# EAGLE design esp32-gps-eth-v12exp (EAGLE 7.3.0)
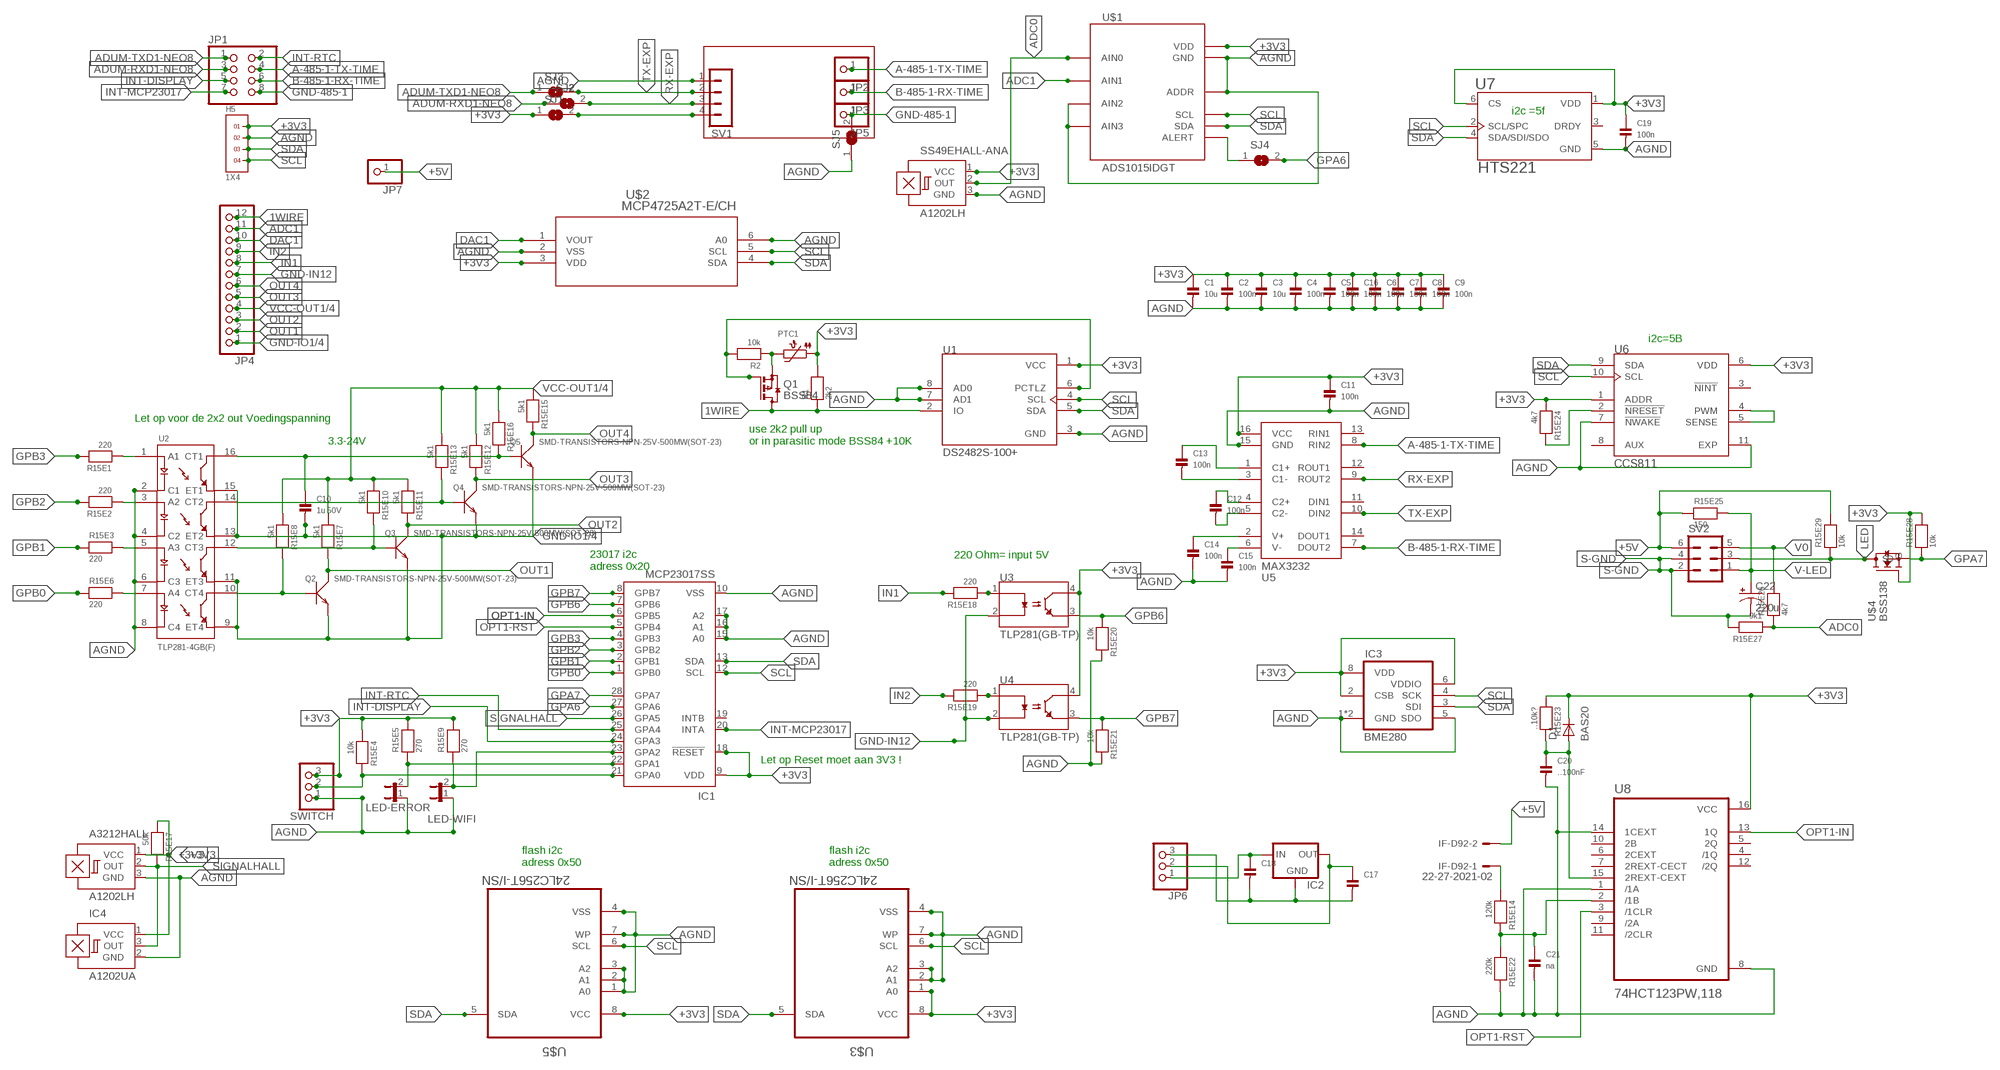
[diagram p0: schematic, sheet 1]

## Parts
A3212HALL  A1202LH  [SOT23-W]
C1  10u  CAP_CERAMIC0805  [0805]
C2  100n  CAP_CERAMIC0805  [0805]
C3  10u  CAP_CERAMIC0805  [0805]
C4  100n  CAP_CERAMIC0805  [0805]
C5  100n  CAP_CERAMIC0805  [0805]
C6  100n  CAP_CERAMIC0805  [0805]
C7  100n  CAP_CERAMIC0805  [0805]
C8  100n  CAP_CERAMIC0805  [0805]
C9  100n  CAP_CERAMIC0805  [0805]
C10  1u 50V  CAP_CERAMIC0805  [0805]
C11  100n  CAP_CERAMIC0805  [0805]
C12  100n  CAP_CERAMIC0805  [0805]
C13  100n  CAP_CERAMIC0805  [0805]
C14  100n  CAP_CERAMIC0805  [0805]
C15  100n  CAP_CERAMIC0805  [0805]
C16  100n  CAP_CERAMIC0805  [0805]
C17  CAP_CERAMIC0805  [0805]
C18  CAP_CERAMIC0805  [0805]
C19  100n  CAP_CERAMIC0805  [0805]
C20  ..100nF  CAP_CERAMIC0805  [0805]
C21  na  CAP_CERAMIC0805  [0805]
C22  220u  CPOL-US153CLV-0605  [153CLV-0605]
D1  BAS20  [SOT23]
H5  1X4  [1X4]
IC1  MCP23017SS  [SSOP28]
IC2  LM1117TO263  [TO263]
IC3  BME280  [BME280]
IC4  A1202UA  [SIP3-UA]
IF-D92  22-27-2021-02  [6410-02]
JP1  PINHD-2X4  [2X04]
JP2  PINHD-1X1  [1X01]
JP3  PINHD-1X1  [1X01]
JP4  PINHD-1X12  [1X12]
JP5  PINHD-1X1  [1X01]
JP6  PINHD-1X3  [1X03]
JP7  PINHD-1X1  [1X01]
LED-ERROR  JP1E  [JP1]
LED-WIFI  JP1E  [JP1]
PTC1  PTC1206  [1206]
Q1  BSS84  [SOT23]
Q2  SMD-TRANSISTORS-NPN-25V-500MW(SOT-23)  [SOT-23]
Q3  SMD-TRANSISTORS-NPN-25V-500MW(SOT-23)  [SOT-23]
Q4  SMD-TRANSISTORS-NPN-25V-500MW(SOT-23)  [SOT-23]
Q5  SMD-TRANSISTORS-NPN-25V-500MW(SOT-23)  [SOT-23]
R1  2k2  RESISTOR0805  [0805]
R2  10k  RESISTOR0805  [0805]
R15E1  220  RESISTOR_0805  [_0805]
R15E2  220  RESISTOR_0805  [_0805]
R15E3  220  RESISTOR_0805  [_0805]
R15E4  10k  RESISTOR_0805  [_0805]
R15E5  270  RESISTOR_0805  [_0805]
R15E6  220  RESISTOR_0805  [_0805]
R15E7  5k1  RESISTOR_0805  [_0805]
R15E8  5k1  RESISTOR_0805  [_0805]
R15E9  270  RESISTOR_0805  [_0805]
R15E10  5k1  RESISTOR_0805  [_0805]
R15E11  5k1  RESISTOR_0805  [_0805]
R15E12  5k1  RESISTOR_0805  [_0805]
R15E13  5k1  RESISTOR_0805  [_0805]
R15E14  120k  RESISTOR_0805  [_0805]
R15E15  5k1  RESISTOR_0805  [_0805]
R15E16  5k1  RESISTOR_0805  [_0805]
R15E17  50k  RESISTOR_0805  [_0805]
R15E18  220  RESISTOR_0805  [_0805]
R15E19  220  RESISTOR_0805  [_0805]
R15E20  10k  RESISTOR_0805  [_0805]
R15E21  10k  RESISTOR_0805  [_0805]
R15E22  220k  RESISTOR_0805  [_0805]
R15E23  ..10k?  RESISTOR_0805  [_0805]
R15E24  4k7  RESISTOR_0805  [_0805]
R15E25  150  RESISTOR_0805  [_0805]
R15E26  4k7  RESISTOR_0805  [_0805]
R15E27  9k1  RESISTOR_0805  [_0805]
R15E28  10k  RESISTOR_0805  [_0805]
R15E29  10k  RESISTOR_0805  [_0805]
SJ1  SJ  [SJ]
SJ2  SJ  [SJ]
SJ3  SJ  [SJ]
SJ4  SJ  [SJ]
SJ5  SJ  [SJ]
SS49EHALL-ANA  A1202LH  [SOT23-W]
SV1  MA04-1  [MA04-1]
SV2  MA03-2  [MA03-2]
SWITCH  PINHD-1X3  [1X03]
U1  DS2482S-100+  [SOIC127P600X175-8N]
U2  TLP281-4GB(F)  [SOIC127P700X210-16N]
U3  TLP281(GB-TP)  [SOIC127P700X210-4N]
U4  TLP281(GB-TP)  [SOIC127P700X210-4N]
U5  MAX3232  [SO16]
U6  CCS811  [SON60P270X400X110-11N]
U7  HTS221  [XDCR_HTS221]
U8  74HCT123PW,118  [SOP65P640X110-16N]
U$1  ADS1015IDGT  [MSOP10_0.5]
U$2  MCP4725A2T-E/CH  [SOT-23-6_MC]
U$3  24LC256T-I/SN  [SOIC127P600X175-8N]
U$4  BSS138  [BSS138]
U$5  24LC256T-I/SN  [SOIC127P600X175-8N]

## Nets
1WIRE: JP4.12 Q1.3(D) R1.1 U1.2(IO)
5VIN: C18.1 IC2.3(IN) JP6.1
+3V3: A3212HALL.1(VCC) C1.1 C2.1 C3.1 C4.1 C5.1 C6.1 C7.1 C8.1 C9.1 C11.1 C16.1 C19.1 D1.3(K) H5.1 IC1.9(VDD) IC1.18(!RESET) IC3.2(CSB) IC3.6(VDDIO) IC3.8(VDD) IC4.1(VCC) PTC1.1 R1.2 R15E4.1 R15E5.2 R15E9.2 R15E17.1 R15E23.1 R15E24.1 R15E28.2 SJ1.1 SS49EHALL-ANA.1(VCC) SWITCH.3 U1.1(VCC) U3.4(COLLECTOR) U4.4(COLLECTOR) U5.16(VCC) U6.1(ADDR) U6.6(VDD) U7.1(VDD) U7.6(CS) U8.16(VCC) U$1.8(VDD) U$2.3(VDD) U$3.1(A0) U$3.8(VCC) U$4.G U$5.8(VCC)
+5V: IF-D92.2 JP7.1 R15E25.1 R15E29.2 SV2.6
A-485-1-TX-TIME: JP1.4 JP2.1 U5.8(RIN2)
ADC0: R15E26.1 R15E27.1 SS49EHALL-ANA.2(OUT) U$1.4(AIN0)
ADC1: JP4.11 U$1.5(AIN1)
ADUM-RXD1-NEO8: JP1.3 SJ2.1
ADUM-TXD1-NEO8: JP1.1 SJ3.1
AGND: A3212HALL.3(GND) C1.2 C2.2 C3.2 C4.2 C5.2 C6.2 C7.2 C8.2 C9.2 C11.2 C14.2 C15.2 C16.2 C19.2 C20.2 C21.2 H5.2 IC1.10(VSS) IC1.15(A0) IC1.16(A1) IC1.17(A2) IC3.1(GND) IC3.5(SDO) IC3.7(GND) IC4.2(GND) LED-ERROR.1 LED-WIFI.1 R15E20.2 R15E21.2 R15E22.2 SJ5.1 SS49EHALL-ANA.3(GND) SV1.1 SWITCH.1 U1.3(GND) U1.7(AD1) U1.8(AD0) U2.2(C1) U2.4(C2) U2.6(C3) U2.8(C4) U5.15(GND) U6.7(!NWAKE) U6.11(EXP) U7.5(GND) U8.1(/1A) U8.8(GND) U8.14(1CEXT) U$1.1(ADDR) U$1.3(GND) U$1.6(AIN2) U$1.7(AIN3) U$2.2(VSS) U$2.6(A0) U$3.2(A1) U$3.3(A2) U$3.4(VSS) U$3.7(WP) U$5.1(A0) U$5.2(A1) U$5.3(A2) U$5.4(VSS) U$5.7(WP)
B-485-1-RX-TIME: JP1.6 JP3.1 U5.7(DOUT2)
DAC1: JP4.10 U$2.1(VOUT)
GND-485-1: JP1.8 JP5.1 SJ5.2
GND-IN: C17.2 C18.2 IC2.1(GND) JP6.3
GND-IN12: JP4.7 U3.2(CATHODE) U4.2(CATHODE)
GND-IO1/4: C10.2 JP4.1 Q2.2(E) Q3.2(E) Q4.2(E) Q5.2(E) U2.9(ET4) U2.11(ET3) U2.13(ET2) U2.15(ET1)
GPA6: IC1.27(GPA6) SJ4.2
GPA7: IC1.28(GPA7) R15E28.1 U$4.S
GPB0: IC1.1(GPB0) R15E6.1
GPB1: IC1.2(GPB1) R15E3.1
GPB2: IC1.3(GPB2) R15E2.2
GPB3: IC1.4(GPB3) R15E1.2
GPB6: IC1.7(GPB6) R15E20.1 U3.3(EMITTER)
GPB7: IC1.8(GPB7) R15E21.1 U4.3(EMITTER)
IN1: JP4.8 R15E18.2
IN2: JP4.9 R15E19.2
INT-DISPLAY: IC1.24(GPA3) JP1.5
INT-MCP23017: IC1.20(INTA) JP1.7
INT-RTC: IC1.25(GPA4) JP1.2
LED: R15E29.1 SV2.3 U$4.D
N$1: PTC1.2 Q1.2(S) R2.1
N$2: C13.1 U5.1(C1+)
N$3: SJ1.2 SV1.4
N$4: Q1.1(G) R2.2 U1.6(PCTLZ)
N$5: Q2.1(B) R15E8.2 U2.10(CT4)
N$6: R15E2.1 U2.3(A2)
N$7: R15E1.1 U2.1(A1)
N$8: IC1.21(GPA0) R15E4.2 SWITCH.2
N$9: IC1.22(GPA1) LED-ERROR.2 R15E5.1
N$10: IC1.23(GPA2) LED-WIFI.2 R15E9.1
N$11: R15E3.2 U2.5(A3)
N$12: R15E6.2 U2.7(A4)
N$13: Q3.1(B) R15E10.2 U2.12(CT3)
N$14: Q4.1(B) R15E13.2 U2.14(CT2)
N$15: C10.1 Q5.1(B) R15E16.2 U2.16(CT1)
N$16: C13.2 U5.3(C1-)
N$17: R15E19.1 U4.1(ANODE)
N$18: R15E18.1 U3.1(ANODE)
N$19: SJ4.1 U$1.2(ALERT)
N$20: C12.1 U5.4(C2+)
N$21: C12.2 U5.5(C2-)
N$25: C14.1 U5.2(V+)
N$26: C15.1 U5.6(V-)
N$35: R15E24.2 U6.2(!NRESET)
N$38: IF-D92.1 R15E14.1
N$39: C21.1 R15E14.2 R15E22.1 U8.2(/1B)
N$40: U6.4(PWM) U6.5(SENSE)
N$41: C20.1 D1.1(A) R15E23.2 U8.15(2REXT-CEXT)
OPT1-IN: IC1.6(GPB5) U8.13(1Q)
OPT1-RST: IC1.5(GPB4) U8.3(/1CLR)
OUT1: JP4.2 Q2.3(C) R15E7.2
OUT2: JP4.3 Q3.3(C) R15E11.2
OUT3: JP4.5 Q4.3(C) R15E12.2
OUT4: JP4.6 Q5.3(C) R15E15.2
RX-EXP: SJ2.2 SV1.3 U5.9(ROUT2)
S-GND: C22.- R15E27.2 SV2.2 SV2.4
SCL: H5.4 IC1.12(SCL) IC3.4(SCK) U1.4(SCL) U6.10(SCL) U7.2(SCL/SPC) U$1.10(SCL) U$2.5(SCL) U$3.6(SCL) U$5.6(SCL)
SDA: H5.3 IC1.13(SDA) IC3.3(SDI) U1.5(SDA) U6.9(SDA) U7.4(SDA/SDI/SDO) U$1.9(SDA) U$2.4(SDA) U$3.5(SDA) U$5.5(SDA)
SIGNALHALL: A3212HALL.2(OUT) IC1.26(GPA5) IC4.3(OUT) R15E17.2
TX-EXP: SJ3.2 SV1.2 U5.10(DIN2)
V0: R15E26.2 SV2.5
V-LED: C22.+ R15E25.2 SV2.1
VCC-OUT1/4: JP4.4 R15E7.1 R15E8.1 R15E10.1 R15E11.1 R15E12.1 R15E13.1 R15E15.1 R15E16.1
VOUT: C17.1 IC2.2(OUT) JP6.2
Unconnected: IC1.19(INTB) U5.11(DIN1) U5.12(ROUT1) U5.13(RIN1) U5.14(DOUT1) U6.3(!NINT) U6.8(AUX) U7.3(DRDY) U8.4(/1Q) U8.5(2Q) U8.6(2CEXT) U8.7(2REXT-CECT) U8.9(/2A) U8.10(2B) U8.11(/2CLR) U8.12(/2Q)

## Notes on the sheet
- i2c =5f
- i2c=5B
- Let op voor de 2x2 out Voedingspanning
- 3.3-24V
- use 2k2 pull up
  or in parasitic mode BSS84 +10K
- 220 Ohm= input 5V
- 23017 i2c 
  adress 0x20
- Let op Reset moet aan 3V3 !
- flash i2c
  adress 0x50
- flash i2c
  adress 0x50

## Library data of the parts
A3212HALL IC4 SS49EHALL-ANA = allegro:A12*?: Hall-effect bipolar switch Source: http://www.allegromicro.com/en/Products/Part_Numbers/1202/1202.pdf; OC_FARNELL: unknown; OC_NEWARK: unknown
C1-C21 = microbuilder:CAP_CERAMIC: Ceramic Capacitors 0402 - 0402 Surface Mount Capacitors 16pF 50V 5% [Digikey: 445-4899-2-ND] 18pF 50V 5% [Digikey: 490-1281-2-ND] 22pF 50V 5% [Digikey: 490-1283-2-ND] 68pF 50V 5% [Digikey: 490-1289-2-ND] 0.1uF 10V 10% [Digikey: 490-1318-2-ND] 1.0uF 6.3V 10% [Digikey: 490-1320-2-ND] 0603 - 0603 Surface Mount Capacitors 16 pF 50V 5% [Digikey: 445-5051-2-ND] 22 pF 50V [Digikey: PCC220ACVTR-ND] 33 pF 50V 5% [Digikey: 490-1415-1-ND] 56pF 50V 5% [Digikey: 490-1421-1-ND] 220pF 50V 5% [Digikey: 445-1285-1-ND] 680 pF 50V 2200 pF 50V 5% C0G [Digikey: 445-1297-1-ND] 5600 pF 100V 5% X7R [Digikey: 478-3711-1-ND] 0.1 µF 25V 10% [Digikey: PCC2277TR-ND] 0.22 µF 16V 10% X7R [Digikey: 445-1318-1-ND] 1.0 µF 25V 10% [Digikey: 445-5146-2-ND] 0603 - RF Specific 3pF 250V +/-0.1pF RF [Digikey: 712-1347-1-ND] 18 pF 250V 5% [Digikey: 478-3505-1-ND or 712-1322-1-ND] 56 pF 250V 5% C0G RF [Digikey: 490-4867-1-ND] 68 pF 250V RF [Digikey: 490-4868-1-ND] 0805 - 0805 Surface Mount Capacitors 220 pF 250V 2% RF Ceramic Capacitor [Digikey: 712-1398-1-ND] 1000 pF 50V 2% NP0 Ceramic Capacitor [Digikey: 478-3760-1-ND] 0.1 µF 25V 10% Ceramic Capacitor [Digikey: PCC1828TR-ND] 1.0 µF 16V 10% Ceramic Capacitor[Digikey: 490-1691-2-ND] 10.0 µF 10V 10% Ceramic Capacitor[Digikey: 709-1228-1-ND] 10.0 uF 16V 10% Ceramic Capacitor [Digikey: 478-5165-2-ND] 47 uF 6.3V 20% Ceramic Capacitor [Digikey: 587-1779-1-ND or 399-5506-1-ND] 1206 - 1206 Surface Mount Capacitors 47uF 10V 20% Ceramic Capacitor [Digikey: 490-5528-1-ND or 399-5508-1-ND or 445-6010-1-ND] 100uF 6.3V -20%, +80% Y5V Ceramic Capacitor (Digikey: 490-4512-1-ND, Mouser: 81-GRM31CF50J107ZE1L)
C22 = adafruit:CPOL-US: POLARIZED CAPACITOR, American symbol
D1 = BAS20:BAS20: General purpose diode The BAS19, BAS20 and BAS21 are general purpose diodes fabricated in planar technology, and encapsulated in a small SOT23 plastic SMD package. AAL Eindhoven MK; AVAILABILITY: Unavailable; DESCRIPTION: BAS20 Series 350 mW 200 V Max Reverse Voltage 200 mA High Voltage Diode-SOT-23-3; MF: ON Semiconductor; MP: BAS20; PACKAGE: SOT-23 ON Semiconductor; PRICE: None
H5 = headers(.1in):1X4
IC1 = microchip:MCP23017: http://ww1.microchip.com/downloads/en/DeviceDoc/21952a.pdf Source: http://ww1.microchip.com/downloads/en/DeviceDoc/21952a.pdf; MF: MICROCHIP; MPN: MCP23017-E/SS; OC_FARNELL: 1467674; OC_NEWARK: 31K2960
IC2 = v-reg-3:LM1117
IC3 = bosch-bme280:BME280: DIGITAL HUMIDITY, PRESSURE AND TEMPERATURE SENSOR * Digital interface I²C (up to 3.4 MHz) and SPI (3 and 4 wire, up to 10 MHz)* Supply voltage VDD main supply voltage range: 1.71 V to 3.6 V*VDDIO interface voltage range: 1.2 V to 3.6 V Operating range -40…+85 °C, 0…100 % rel. humidity, 300…1100 hPa The library has been designed by Richard Magdycz <https://www.facebook.com/groups/eaglecadsoftUK>
IF-D92 = con-molex:22-?-02: CONNECTOR wire to board 2.54 mm (.1 inch) pitch header; OC_FARNELL: unknown; OC_NEWARK: unknown
JP1 = adafruit:PINHD-2X4: PIN HEADER
JP2 JP3 JP5 JP7 = adafruit:PINHD-1X1: Pin header 1x1 for 0.1" spacing With round pins
JP4 = adafruit:PINHD-1X12: PIN HEADER
JP6 SWITCH = adafruit:PINHD-1X3: PIN HEADER
LED-ERROR LED-WIFI = jumper:JP1E: JUMPER
PTC1 = microbuilder:PTC: PTC (Resettable Fuse) 1206 Package 250mA PTC (16V Max, Time-to-Trip: 0.08s) - Digikey: F2110CT-ND 1210 Package 100mA PTC (30V Max, Time-to-Trip: 0.6s) - Digikey: MF-USMF010-2CT-ND 1812 Package 750mA PTC (24V Max, Time-to-Trip: 0.2s) - Digikey: MF-MSMF075/24-2CT-ND
Q1 = transistor-small-signal:BSS84: P-CHANNEL MOS FET
Q2-Q5 = SMD-TRANSISTORS-NPN-25V-500MW_SOT-23_:SMD-TRANSISTORS-NPN-25V-500MW(SOT-23): 305010017; AVAILABILITY: Unavailable; MF: Micro Commercial; MP: S8050; PACKAGE: SOT-23 Micro Commercial; PRICE: None
R1 R2 R15E1-R15E29 = microbuilder:RESISTOR: Resistors 0402 - 0402 Surface Mount Package 22 Ohm 1% 1/16W [Digikey: 311-22.0LRTR-ND] 33 Ohm 5% 1/16W 1.0K 5% 1/16W 1.5K 5% 1/16W 2.0K 1% 1/16W 10.0K 1% 1/16W [Digikey: 311-10.0KLRTR-ND] 10.0K 5% 1/16W [Digikey: RMCF0402JT10K0TR-ND] 12.1K 1% 1/16W [Digikey: 311-22.0LRTR-ND] 100.0K 5% 1/16W 0603 - 0603 Surface Mount Package 0 Ohm 1/10 Watt 1% Resistor 15 Ohm 1/10 Watt 1% Resistor 33 Ohm 1/10 Watt 1% Resistor 49.9 Ohm 1/10 Watt 1% Resistor 100 Ohm 1/10 Watt 1% Resistor 150 Ohm 1/10 Watt 1% Resistor 240 Ohm 1/10 Watt 1% Resistor 390 Ohm 1/10 Watt 1% Resistor 560 Ohm 1/10 Watt 1% Resistor 680 Ohm 1/10 Watt 1% Resistor 750 Ohm 1/10 Watt 1% Resistor 1.0K Ohm 1/10 Watt 1% Resistor 1.5K Ohm 1/10 Watt 1% Resistor 2.0K Ohm 1/10 Watt 1% Resistor 2.2K Ohm 1/10 Watt 1% Resistor 3.3K Ohm 1/10 Watt 1% Resistor 4.7K Ohm 1/10 Watt 1% Resistor 10.0K Ohm 1/10 Watt 1% Resistor 12.0K Ohm 1/10 Watt 1% Resistor 12.1K Ohm 1/10 Watt 1% Resistor 20.0K Ohm 1/10 Watt 1% Resistor 33.0K Ohm 1/10 Watt 1% Resistor 100.0K Ohm 1/10 Watt 1% Resistor 0805 - 0805 Surface Mount Package 0 Ohm 1/8 Watt 1% Resistor 33 Ohm 1/8 Watt 1% Resistor 100 Ohm 1/8 Watt 1% Resistor 150 Ohm 1/8 Watt 1% Resistor 200 Ohm 1/8 Watt 1% Resistor 240 Ohm 1/8 Watt 1% Resistor 330 Ohm 1/8 Watt 1% Resistor 390 Ohm 1/8 Watt 1% Resistor 470 Ohm 1/8 Watt 1% Resistor 1.0K Ohm 1/8 Watt 1% Resistor 1.5K Ohm 1/8 Watt 1% Resistor 2.0K Ohm 1/8 Watt 1% Resistor 4.7K Ohm 1/8 Watt 1% Resistor 5.1K Ohm 1/8 Watt 1% Resistor 5.6K Ohm 1/8 Watt 1% Resistor 10.0K Ohm 1/8 Watt 1% Resistor 22.0K Ohm 1/8 Watt 1% Resistor 33.0K Ohm 1/8 Watt 1% Resistor 100K Ohm 1/8 Watt 1% Resistor 1206 - 1206 Surface Mount Package 2012 - 2010 Surface Mount Package 0.11 Ohm 1/2 Watt 1% Resistor - Digikey: RHM.11UCT-ND
SJ1-SJ5 = jumper:SJ: SMD solder JUMPER
SV1 = con-lstb:MA04-1: PIN HEADER; OC_FARNELL: unknown; OC_NEWARK: unknown
SV2 = con-lstb:MA03-2: PIN HEADER; OC_FARNELL: unknown; OC_NEWARK: unknown
U1 = DS2482S-100_:DS2482S-100+: DS2460S Series 5.5 V 400 kHz I2C Surface Mount Smart Card Interface IC - SOIC-8; AVAILABILITY: Unavailable; DESCRIPTION: I²C to 1-wire Interface-IC [Maxim] DS2482S-100+ I²C to 1-wire Interface-IC; MF: Maxim Integrated; MP: DS2482S-100+; PACKAGE: SOIC-8 Maxim; PRICE: None
U2 = TLP281-4GB_F_:TLP281-4GB(F): Optocoupler DC-IN 4-CH Transistor DC-OUT 16-Pin SOP; AVAILABILITY: Unavailable; DESCRIPTION: Optocoupler DC-IN 4-CH Transistor DC-OUT 16-Pin SOP; MF: Toshiba; MP: TLP281-4GB_F_; PACKAGE: SOP-16 Toshiba; PRICE: None
U3 U4 = TLP281_GB-TP_:TLP281(GB-TP): Optocoupler DC-IN 1-CH Transistor DC-OUT 4-Pin SOP T/R; AVAILABILITY: Unavailable; DESCRIPTION: Optocoupler DC-IN 1-CH Transistor DC-OUT 4-Pin SOP T/R; MF: Toshiba Semiconductor; MP: TLP281_GB-TP_; PACKAGE: SOP-4 Toshiba; PRICE: None
U5 = MAX3232:MAX3232: RS-232 Line Driver/Receiver; AVAILABILITY: Unavailable; MF: Texas Instruments; MP: MAX3232; PACKAGE: SOIC-16 Texas Instruments; PRICE: None
U6 = CCS811:CCS811: Low Power Digital Sensor For Ind; AVAILABILITY: Unavailable; DESCRIPTION: Low Power Digital Sensor For Ind; MF: ams; MP: CCS811; PACKAGE: LGA-11 ams; PRICE: None
U7 = HTS221:HTS221: Capacitive digital sensor for relative humidity and temperature; AVAILABILITY: Unavailable; DESCRIPTION: Capacitive digital sensor for relative humidity and temperature; MF: STMicroelectronics; MP: HTS221; PACKAGE: VFLGA-6 STMicroelectronics; PRICE: None
U8 = 74HCT123PW_118:74HCT123PW,118: None; AVAILABILITY: Unavailable; DESCRIPTION: 74HC_T_123 - Dual retriggerable monostable multivibrator with reset; MF: Nexperia USA; MP: 74HCT123PW,118; PACKAGE: TSSOP-16 NXP Semiconductors; PRICE: None
U$1 = ADS1015:ADS1015: Ti ADS1015 12-bit ADC Ultra-Small, Low-Power, 12-Bit Analog-to-Digital Converter with Internal Reference The ADS1013, ADS1014, and ADS1015 are precision analog-to-digital converters (ADCs) with 12 bits of resolution offered in an ultra-small, leadless QFN-10 package or an MSOP-10 package. \ Source: http://focus.ti.com/docs/prod/folders/print/ads1015.html; AVAILABILITY: Unavailable; DESCRIPTION: 12-Bit ADC with Integrated MUX PGA Comparator Oscillator and Reference; MF: Texas Instruments; MP: ADS1015; PACKAGE: XFQFN-10 Texas Instruments; PRICE: None
U$2 = MCP4725A2T-E_CH:MCP4725A2T-E/CH; AVAILABILITY: Unavailable; DESCRIPTION: MCP4725 Series 1 Ch I2C EEPROM Memory 5.5 V 12-Bit D/A Converter SMT - SOT-23-6; MF: Microchip; MP: MCP4725A2T-E/CH; PACKAGE: SOT-23-6 Microchip; PRICE: None
U$3 U$5 = Microchip_By_element14_Batch_1:24LC256T-I/SN: 256K I2C CMOS Serial EEPROM; MPN: 24LC256T-I/SN; OC_FARNELL: 1296581; OC_NEWARK: 27C9147; PACKAGE: SOIC-8; SUPPLIER: MICROCHIP
U$4 = Ava:BSS138: BSS138 N-Channel Logic Level Enhancement Mode Field Effect Transistor

## Board
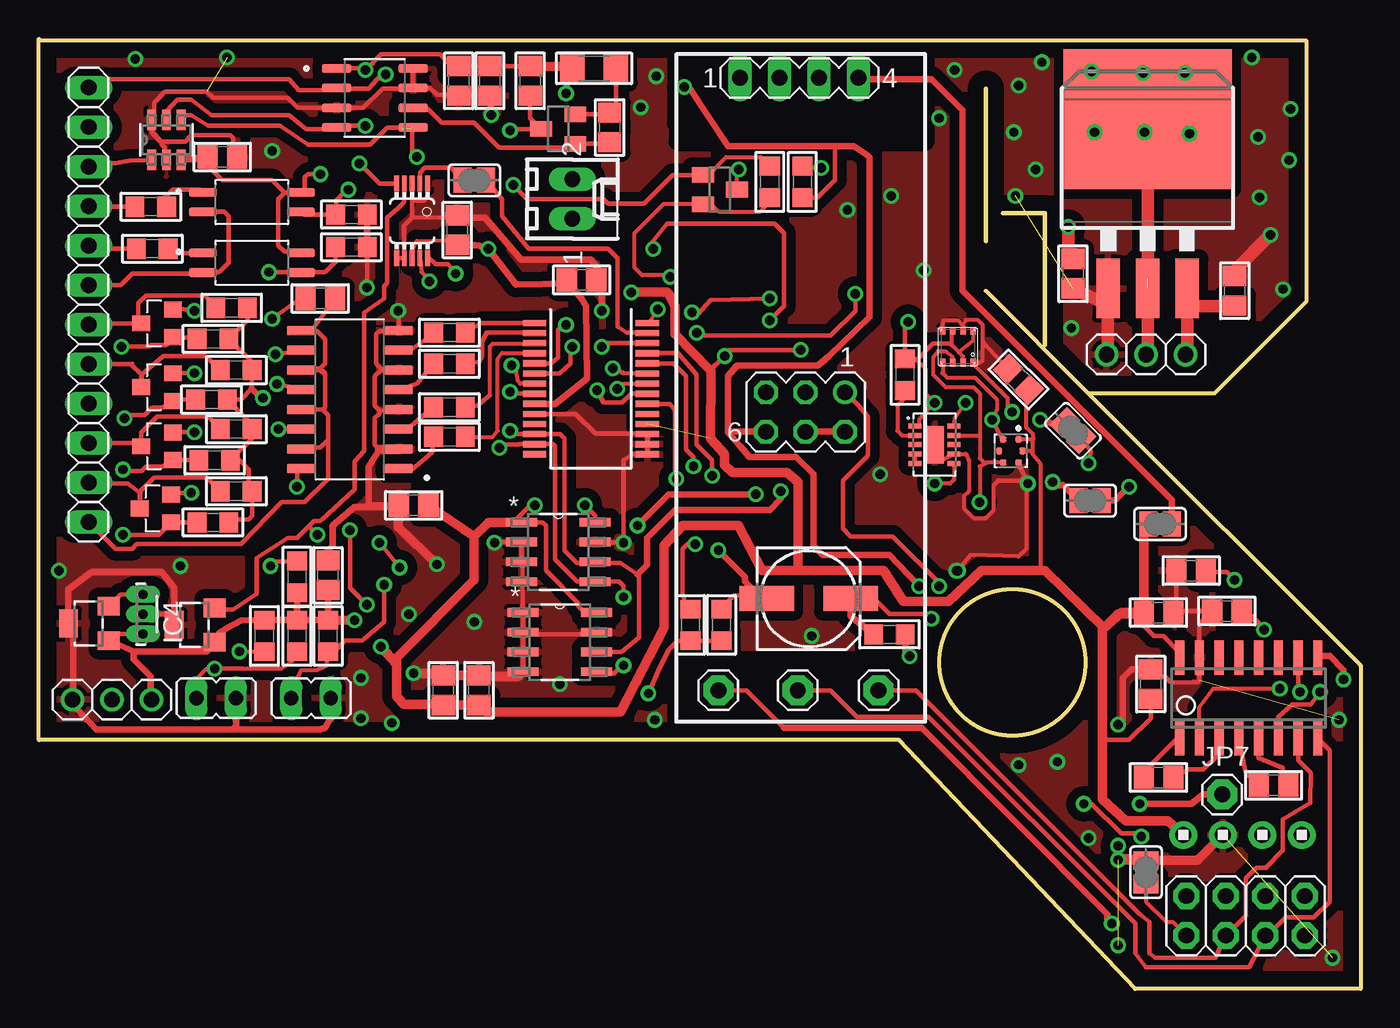
[diagram p1: board, top side]
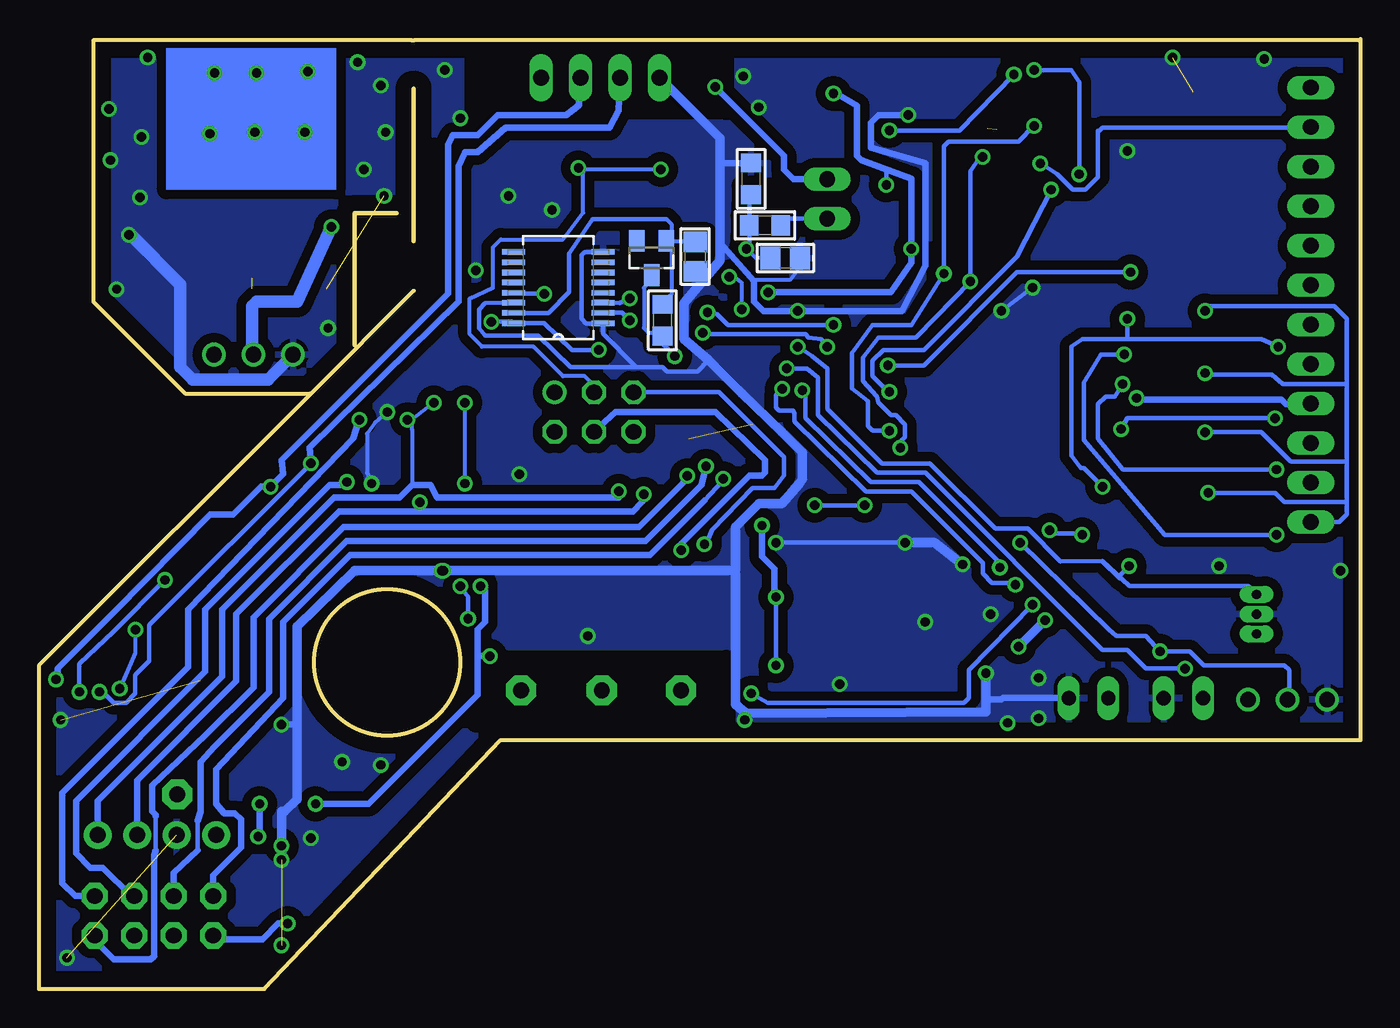
[diagram p2: board, bottom side, seen from below]

Size 85 x 61.1 mm. Coordinates in mm from the lower left corner, seen from the top.
Outline: 0.1,61 60.9,61
Outline: 60.9,44.9 67.5,38.3
Outline: 67.5,38.3 85,20.8 85,0 70.5,0 55.3,16 0,16 0,61.1
Outline: 60.9,57.9 60.9,48.1
Outline: 61,61 81.5,61 81.5,44.2 75.6,38.3 67.5,38.3
Outline: 64.7,41.4 64.7,49.9 62,49.9
Outline: circle at 62.6,21 radius 4.7
Copper layers (1*16): Top 0.035mm / dielectric 1.5mm / Bottom 0.035mm
Design rules "default *": minimum track width 5mil, minimum drill 24mil, track to track 5mil, track to pad 8mil, pad to pad 8mil, via to via 8mil, smd to smd 8mil, copper to edge 40mil, drill to drill 8mil, minimum pad ring 10mil, minimum via ring 8mil, stop-mask expansion 4mil, vias tented up to drill 0mil, thermal gap 10mil
tKeepout: area 41,17.2 to 57.1,21.3
tRestrict: area 41,16.7 to 56.9,21.1; area 41,55.7 to 56.9,60.1; area 41.1,56.5 to 57,60.9; area 41.1,54.5 to 57,58.9
bRestrict: area 40.8,17.1 to 56.9,21.2; area 40.9,56.5 to 57,60.6

### Footprints (pad centres in the part's own frame; a part is rotated, then mirrored left to right if it is on the bottom)
SOT23-W = smd 1.2 x 1.4: 1 -1.1,-1.3; 2 1.1,-1.3 | smd 1.8 x 1.2: 3 0,1.3
0805 = smd 1.3 x 1.5: 1 -0.95,0; 2 0.95,0
153CLV-0605 = smd 3.5 x 1.6: + 2.7,0; - -2.7,0
SOT23 = smd 1 x 1.4: 1 -0.95,-1.1; 2 0.95,-1.1; 3 0,1.1
1X4 = drill 1.016 pad 1.778: 1 0,0; 2 2.54,0; 3 5.08,0; 4 7.62,0
SSOP28 = smd 0.4 x 1.5: 1 -4.225,-3.625; 2 -3.575,-3.625; 3 -2.925,-3.625; 4 -2.275,-3.625; 5 -1.625,-3.625; 6 -0.975,-3.625; 7 -0.325,-3.625; 8 0.325,-3.625; 9 0.975,-3.625; 10 1.625,-3.625; 11 2.275,-3.625; 12 2.925,-3.625; 13 3.575,-3.625; 14 4.225,-3.625; 15 4.225,3.625; 16 3.575,3.625; 17 2.925,3.625; 18 2.275,3.625; 19 1.625,3.625; 20 0.975,3.625; 21 0.325,3.625; 22 -0.325,3.625; 23 -0.975,3.625; 24 -1.625,3.625; 25 -2.275,3.625; 26 -2.925,3.625; 27 -3.575,3.625; 28 -4.225,3.625
TO263 = smd 1.524 x 3.81: 1 -2.54,-8.255; 2 0,-8.255; 3 2.54,-8.255 | smd 10.8 x 9: 4 0,2.635
BME280 = smd 0.35 x 0.5: 1 0.975,-1.025; 2 0.325,-1.025; 3 -0.325,-1.025; 4 -0.975,-1.025; 5 -0.975,1.025; 6 -0.325,1.025; 7 0.325,1.025; 8 0.975,1.025
SIP3-UA = drill 0.6 pad 0.7 long: 1 -1.27,0; 2 0,0; 3 1.27,0
6410-02 = drill 1.016 long: 1 1.27,0; 2 -1.27,0
2X04 = drill 1.016 pad 1.676 octagon: 1 -3.81,-1.27; 2 -3.81,1.27; 3 -1.27,-1.27; 4 -1.27,1.27; 5 1.27,-1.27; 6 1.27,1.27; 7 3.81,-1.27; 8 3.81,1.27
1X01 = drill 1.016 pad 1.93 octagon: 1 0,0
1X12 = drill 1.016 long: 1 -13.97,0; 2 -11.43,0; 3 -8.89,0; 4 -6.35,0; 5 -3.81,0; 6 -1.27,0; 7 1.27,0; 8 3.81,0; 9 6.35,0; 10 8.89,0; 11 11.43,0; 12 13.97,0
1X03 = drill 1.016: 1 -2.54,0; 2 0,0; 3 2.54,0
JP1 = drill 0.914 long: 1 0,-1.27; 2 0,1.27
1206 = smd 1.6 x 1.8: 1 -1.4,0; 2 1.4,0
SOT-23 = smd 1.016 x 1.143: 1 -0.889,-1.016; 2 0.889,-1.016; 3 0,1.016
_0805 = smd 1.2 x 1.3: 1 -1.016,0; 2 1.016,0
SJ = smd 1.168 x 1.6: 1 -0.762,0; 2 0.762,0
MA04-1 = drill 1.016 long: 1 -3.81,0; 2 -1.27,0; 3 1.27,0; 4 3.81,0
MA03-2 = drill 1.016: 1 -2.54,-1.27 | drill 1.016 octagon: 2 -2.54,1.27; 3 0,-1.27; 4 0,1.27; 5 2.54,-1.27; 6 2.54,1.27
SOIC127P600X175-8N = smd 1.9 x 0.6: 1 -2.455,1.905; 2 -2.455,0.635; 3 -2.455,-0.635; 4 -2.455,-1.905; 5 2.455,-1.905; 6 2.455,-0.635; 7 2.455,0.635; 8 2.455,1.905
SOIC127P700X210-16N = smd 1.8 x 0.59: 1 -3.155,4.445; 2 -3.155,3.175; 3 -3.155,1.905; 4 -3.155,0.635; 5 -3.155,-0.635; 6 -3.155,-1.905; 7 -3.155,-3.175; 8 -3.155,-4.445; 9 3.155,-4.445; 10 3.155,-3.175; 11 3.155,-1.905; 12 3.155,-0.635; 13 3.155,0.635; 14 3.155,1.905; 15 3.155,3.175; 16 3.155,4.445
SOIC127P700X210-4N = smd 1.8 x 0.59: 1 -3.155,0.635; 2 -3.155,-0.635; 3 3.155,-0.635; 4 3.155,0.635
SO16 = smd 2.2 x 0.6: 1 -2.6,4.445; 2 -2.6,3.175; 3 -2.6,1.905; 4 -2.6,0.635; 5 -2.6,-0.635; 6 -2.6,-1.905; 7 -2.6,-3.175; 8 -2.6,-4.445; 9 2.6,-4.445; 10 2.6,-3.175; 11 2.6,-1.905; 12 2.6,-0.635; 13 2.6,0.635; 14 2.6,1.905; 15 2.6,3.175; 16 2.6,4.445
SON60P270X400X110-11N = smd 0.91 x 0.32: 1 -1.255,1.2; 2 -1.255,0.6; 3 -1.255,0; 4 -1.255,-0.6; 5 -1.255,-1.2; 6 1.255,-1.2; 7 1.255,-0.6; 8 1.255,0; 9 1.255,0.6; 10 1.255,1.2 | smd 1.2 x 2.4: 11 0,0
XDCR_HTS221 = smd 0.4 x 0.45: 1 -0.75,0.5; 2 -0.75,-0.5; 4 0.75,-0.5; 5 0.75,0.5 | smd 0.45 x 0.4: 3 0,-0.75; 6 0,0.75
SOP65P640X110-16N = smd 1.473 x 0.356: 1 -2.87,2.286; 2 -2.87,1.626; 3 -2.87,0.965; 4 -2.87,0.33; 5 -2.87,-0.33; 6 -2.87,-0.965; 7 -2.87,-1.626; 8 -2.87,-2.286; 9 2.87,-2.286; 10 2.87,-1.626; 11 2.87,-0.965; 12 2.87,-0.33; 13 2.87,0.33; 14 2.87,0.965; 15 2.87,1.626; 16 2.87,2.286
MSOP10_0.5 = smd 0.3 x 1.02: 1 -1,-2.4; 2 -0.5,-2.4; 3 0,-2.4; 4 0.5,-2.4; 5 1,-2.4; 6 1,2.4; 7 0.5,2.4; 8 0,2.4; 9 -0.5,2.4; 10 -1,2.4
SOT-23-6_MC = smd 1.321 x 0.559: 1 -1.295,0.95; 2 -1.295,0; 3 -1.295,-0.95; 4 1.295,-0.95; 5 1.295,0; 6 1.295,0.95
SOIC127P600X175-8N' = smd 1.981 x 0.559: 1 -2.362,1.905; 2 -2.362,0.635; 3 -2.362,-0.635; 4 -2.362,-1.905; 5 2.362,-1.905; 6 2.362,-0.635; 7 2.362,0.635; 8 2.362,1.905
BSS138 = smd 1 x 1.4: D 0,1.1; G -0.95,-1.1; S 0.95,-1.1

### Placement (x,y rotation side)
A3212HALL  3.2,23.5 90 top
C1  29,58.4 270 top
C2  27,58.4 270 top
C3  26,19.2 90 top
C4  28.3,19.2 90 top
C5  11.8,53.5 0 top
C6  34.9,45.6 0 top
C7  26.9,48.8 90 top
C8  18.6,26.6 90 top
C9  72,24.2 0 top
C10  18.1,44.4 0 top
C11  24.1,31.1 180 top
C12  79.4,13.1 0 top
C13  72,13.6 0 top
C14  76.4,24.3 180 top
C15  74.1,26.9 180 top
C16  71.5,19.6 90 top
C17  66.5,46 270 top
C18  76.9,44.9 90 top
C19  63,39.2 135 top
C20  42.8,47.1 270 bottom
C21  37,47 0 bottom
C22  49.5,25.1 0 top
D1  45.6,47 180 bottom
H5  73.6,9.9 0 top
IC1  35.5,38.6 270 top
IC2  71.3,53.3 0 top
IC3  59.1,41.3 0 top
IC4  6.7,24.1 90 top
IF-D92  34.3,50.8 270 top
JP1  77.6,4.7 180 top
JP2  48.8,19.2 0 top
JP3  54,19.2 0 top
JP4  3.2,44 90 top
JP5  43.7,19.2 0 top
JP6  71.2,40.8 180 top
JP7  76.1,12.5 0 top
LED-ERROR  17.5,18.7 90 top
LED-WIFI  11.4,18.7 90 top
PTC1  35.7,59.2 0 top
Q1  33.4,55.3 90 top
Q2  7.5,30.9 90 top
Q3  7.6,34.9 90 top
Q4  7.6,38.7 90 top
Q5  7.6,42.8 90 top
R1  31.6,58.4 90 top
R2  36.7,55.4 270 top
R15E1  26.4,35.5 0 top
R15E2  26.4,37.4 0 top
R15E3  26.4,40.2 180 top
R15E4  14.5,22.7 270 top
R15E5  18.6,22.7 90 top
R15E6  26.4,42.2 180 top
R15E7  12.7,32 180 top
R15E8  11.2,30 180 top
R15E9  16.6,22.7 90 top
R15E10  11.3,34 180 top
R15E11  12.7,36 180 top
R15E12  12.7,39.8 180 top
R15E13  11.1,37.9 180 top
R15E14  38.3,49.1 180 bottom
R15E15  12.4,43.8 180 top
R15E16  11.2,41.8 180 top
R15E17  16.6,26.5 90 top
R15E18  7.3,47.6 180 top
R15E19  7.2,50.3 180 top
R15E20  20.1,47.7 0 top
R15E21  20.1,49.8 0 top
R15E22  39.2,52.1 90 bottom
R15E23  44.9,43 90 bottom
R15E24  55.7,39.5 270 top
R15E25  54.7,22.8 180 top
R15E26  41.9,23.4 90 top
R15E27  43.9,23.4 90 top
R15E28  47,51.9 90 top
R15E29  49.1,51.9 270 top
SJ1  72.1,29.9 0 top
SJ2  67.6,31.4 0 top
SJ3  66.5,35.9 315 top
SJ4  28,52 0 top
SJ5  71.2,7.5 270 top
SS49EHALL-ANA  10,23.4 90 top
SV1  48.9,58.6 0 top
SV2  49.3,37.1 180 top
SWITCH  4.7,18.6 0 top
U1  21.6,57.3 0 top
U2  20,37.9 180 top
U3  13.7,46.7 0 top
U4  13.7,50.6 0 top
U5  77.8,18.7 90 top
U6  57.6,35 0 top
U7  62.5,34.6 270 top
U8  51.6,45.1 180 bottom
U$1  24,49.4 180 top
U$2  8.2,54.6 90 top
U$3  24LC256T-I/SN  [SOIC127P600X175-8N']  33.4,28.1 0 top
U$4  43.8,51.4 270 top
U$5  24LC256T-I/SN  [SOIC127P600X175-8N']  33.5,22.3 0 top

### Tracks (layer width: path | path; a pad name or v marks a point on that pad's centre or on a via)
1WIRE  (via drill 0.6)
  Top 0.305: JP4.12 3.53,57.97 3.7,57.8 3.9,57.8 4.6,58.5 16.1,58.5 16.7,57.8 19.01,57.8 U1.2 19.18,57.9 21.2,57.9 22,58.8 v22.3,58.8 | R1.1 31.6,56 Q1.3 30.4,55.3 v30.3,55.2
  Bottom 0.305: v30.3,55.2 25.8,55.2 v22.3,58.8
5VIN
  Top 0.813: IC2.3 73.84,44.1 | 73.84,44.1 73.84,40.9 JP6.1 | C18.1 76.75,43.95 76.7,43.9 74.04,43.9 73.84,44.1
+3V3  (via drill 0.6)  (1 unrouted)
  Top 0.254: U$1.8 24,47.5 24.3,48.1 26.25,48.15 C7.1 | U7.1 63.95,35.35 | 63.8,34.6 63.9,34.5 63.9,35.2 63.95,35.35 | 63.8,34.6 U7.6 | 63.95,35.35 63.9,35.7 63.5,36.1 63.5,38.26 C19.1 63.74,37.9 | 63.8,34.6 63.9,34.4 64.4,33.8 64.4,27 60.6,26.9 | IC3.2 59.43,40.67 59.15,40.95 | 59.15,40.95 58.7,41.4 58.7,42 IC3.6 | IC3.8 60.08,41.67 59.15,40.95 | U6.6 58.86,32.76 58.6,32.5 v57.6,32.5 | U6.1 56.6,36.16 56.6,36.6 v57.6,37.7 57,38.3 57,39.9 56.38,40.52 R15E24.1 | U$4.G 43.05,52.35 44.2,53.5 46.42,53.5 R15E28.2
  Top 0.305: U3.4 16.79,47.4 15.8,47.4 15.4,47.8 15.4,50.8 15.8,51.2 | 15.8,51.2 16.2,51.2 16.24,51.23 U4.4 17.1,51.48 17.1,52.2 17.3,52.4 v18.1,52.4 | C5.1 9.34,53.5 U$2.3 10.61,53.31 10.7,53.4 10.7,53.1 11.8,52 15,52 15.8,51.2 | U1.1 20.9,59.2 v21,59.1 22,60.1 25.8,60.1 26.55,59.35 C2.1 C1.1 R1.2 34.15,59.35 PTC1.1 | U$3.1 32.4,30.01 32.6,29.8 32.6,26.9 34.7,24.8 34.7,24.6 35.2,24.1 35.76,24.1 U$5.8 | U5.16 73.35,21.65 72.3,22.7 71.7,22.7 71.1,23.3 71.1,24.15 C9.1 | C16.1 71.5,17.4 70.1,16 68.7,16 68.5,16.2 68.45,18.65 68.4,18.6 | U$3.8 35.76,30.44 v35.1,31.1 | v31.9,31.1 31.59,31.1 30.5,30.01 | v44.1,40.7 43.9,40.52 43.17,39.79 | v49,41.1 44.4,41.1 44.1,40.8 v44.1,40.7 | v44.1,40.7 43.2,39.8 43.22,39.74 | IC4.1 4.93,22.83 A3212HALL.1 | U$4.G 40.75,52.35 38.9,50.5 36.6,50.5 36.3,50.8 31.4,50.8 v30.5,51.7 | 58.7,41.4 58.6,41.5 57.5,41.5 56.52,40.52 R15E24.1 55.7,42.6 v55.9,42.9
  Top 0.406: IC1.9 31.9,37.6 33.2,37.6 35.25,39.25 35.2,43.9 34.9,44.4 C6.1 34.05,45.35 30.7,45.3 v28.9,47.6 28.3,47.8 | 28.3,47.8 27.55,47.9 C7.1 28.3,47.8 | A3212HALL.1 6.1,21.7 | 6.1,21.7 10.8,21.7 SS49EHALL-ANA.1 11.6,22.9 12.1,23.2 13,23.7 R15E4.1 R15E9.2 | R15E9.2 R15E5.2 C8.1 | R15E9.2 R15E17.1 | 34,59.3 v33.9,57.6 | 6.1,21.7 6.1,21.2 7.2,20.1 7.2,18.64 SWITCH.3
  Top 0.61: H5.1 72.6,10.8 69.9,10.8 68.4,12.2 68.4,18.6 68.4,23.1 | 68.4,23.1 68.5,23.2 | C9.1 70.95,24.1 69.4,24.1 68.5,23.2 | C9.1 69.6,24.2 68.4,23.1 | 68.5,23.2 64.7,26.9 60.6,26.9 58.5,24.9 55.6,24.9 54.3,26.9 48.8,26.9 | 48.8,26.9 46.5,26.9 45,29.8 41.4,29.8 40.2,28.5 40.2,23.2 37.4,17.8 28.75,17.8 C4.1 C3.1 25.95,18.3 23.5,18.3 23,18.8 23,20.9 | C9.1 71.05,28.95 71.1,29.8 71.44,29.8 SJ1.1 | U$3.1 30.5,30.01 28.91,30.01 28,29.1 | 28,29.1 28,26.3 23,21.3 23,20.9 | R15E5.2 v20.3,23.7 | v22,22 23,20.9 | C11.1 28,29.1 | v38.1,44.8 40.4,44.8 40.5,44.7 40.9,43.9 40.9,42.1 43.17,39.79 43.22,39.74 43.2,35.4 44.1,34.4 44.1,33.7 44.6,33.2 48.1,33.2 48.8,32.6 48.8,26.9 | R1.2 34,59.3
  Bottom 0.254: v57.6,32.5 v57.6,37.7 | D1.3 45.6,45.6 46.1,45.1 46.1,42.5 45.8,42.2 45.12,42.2 R15E23.1
  Bottom 0.305: v21,59.1 18.6,59.1 18.1,58.3 v18.1,52.4 | v35.1,31.1 v31.9,31.1 | R15E23.1 45.18,41.78 v44.1,40.7 | v49,41.1 50.7,41.1 52.51,42.81 U8.16 54.56,42.9 55.5,42.9 55.7,42.7 v55.9,42.9 | v30.5,51.7 30.5,52.57 30.71,52.78
  Bottom 0.406: v38.1,44.8 30.2,44.8 28.9,46.7 v28.9,47.6 28.9,52.1 30.71,52.78 32.1,53.3 32.4,53.6 32.4,56.8 33.9,57.7 v33.9,57.6
  Bottom 0.61: v20.3,23.7 v22,22
+5V  (via drill 0.6)
  Top 0.305: v41.5,58 41.8,58 | v70.9,9.8 70.6,9.9 70.5,10 69.6,10 67.7,11.9 v67.2,11.9 | 53.4,53.5 53.3,53.6 | R15E29.2 50.08,50.88 51.2,52 51.2,54.2
  Top 0.406: 41.8,58 44.3,54.2 51.2,54.2 52.4,54.2 53.3,53.6 | JP7.1 74.9,12.5 74.1,11.9 v70.8,11.9 | v56.6,25.9 54.7,27.9 50.4,27.9 49.8,28.5 49.8,33.1 48.7,34.2 45.7,34.2 45.1,34.9 44.35,35.74 | 44.35,35.74 44.3,35.8 44.3,39.4 44.9,40.1 50.1,40.1 50.8,40.7 53.4,43.2 53.4,53.5 | SV2.6 44.44,35.83 44.35,35.74 | R15E25.1 55.72,21.48 v56,21.4
  Bottom 0.305: 70.8,10.1 v70.9,9.8 | 56.3,25.6 v56.6,25.9
  Bottom 0.406: IF-D92.2 36.47,52.07 37.1,52.7 37.1,53.6 v41.5,58 | v70.8,11.9 70.8,10.1 | v67.2,11.9 63.8,11.9 56.8,18.9 56.8,21.4 | 56.8,21.4 56.8,23.1 56.3,23.6 56.3,25.6 | v56,21.4 56.8,21.4
A-485-1-TX-TIME
  Top 0.305: JP2.1 50.9,19.2 52.6,17.5 57.2,17.5 70.5,4.2 70.5,2.3 71.2,1.4 77.84,1.4 JP1.4 79.03,3.43 80.2,4.6 82,4.6 83,5.6 83,15.34 U5.8
ADC0  (via drill 0.6)
  Top 0.305: U$1.4 23.5,50.6 23.1,50.2 22.4,49.6 22.4,45.4 22.2,45.2 22.2,44.4 20.9,43.5 20.9,34.6 20.3,33.9 20.3,32.1 18.2,30.2 18.1,30.1 17.7,30.1 17.35,29.75 | 17.35,29.75 16.6,29 16,29 14,27.7 14,25.4 12.5,24.4 11.4,24.4 11.3,24.9 SS49EHALL-ANA.2 | R15E27.1 R15E26.1 41.08,22.38 40.5,21.8 39.8,20.4 v39.2,19 | v21.1,24.7 20,25.8 v20,29.5 | v17.9,29.2 17.6,29.2 17.6,29.5 17.35,29.75
  Bottom 0.305: v39.2,19 38.1,18.4 25.5,18.4 25.2,18.7 25.2,20.5 v21.1,24.7 | v20,29.5 19.9,29.2 20.2,29.3 18,29.3 v17.9,29.2
ADC1  (via drill 0.6)
  Top 0.305: U$1.5 21.9,51.8 v20.6,53.1
  Bottom 0.305: v20.6,53.1 19.5,52.4 18.5,51.4 17.7,51.4 16.9,52.2 16.9,55.2 16.8,55.2 16.6,55.4 3.23,55.4 JP4.11
ADUM-RXD1-NEO8  (via drill 0.6)
  Top 0.406: v65.2,32.6 65.2,32.3 65.84,32.4 SJ2.1
  Bottom 0.406: JP1.3 79.07,5.97 80.9,7.8 81.7,7.8 82.6,8.7 82.6,12.1 74.3,20.4 74.3,24.4 66.3,32.4 65.1,32.4 v65.2,32.6
ADUM-TXD1-NEO8  (via drill 0.6)
  Top 0.406: v64.4,36.6 65.64,36.2 SJ3.1
  Bottom 0.406: JP1.1 82.67,5.97 83.5,6.8 83.5,12.6 75.4,20.7 75.4,24.4 64.8,35.4 v64.4,36.6
AGND  (via drill 0.6)  (4 unrouted)
  Top 0.254: SJ5.1 70.54,8.26 | IC3.5 58.12,42.72 58.2,43 59.1,43 59.4,42.7 | 59.4,42.7 59.5,42.5 59.5,42.35 IC3.7 | 60.7,41.8 60.7,40.4 60.48,40.28 IC3.1 60.08,40.22 62.3,38 62.3,37.4 v62.6,37.1 | 60.7,41.8 60.7,42.7 60.4,43 59.6,43 59.4,42.7 | 24,50.7 24.8,50.7 25,51 U$1.1 | 24,49.6 26.75,49.6 C7.2 | C19.2 60.75,41.55 60.7,41.8 | v63.6,32.5 63.4,32.9 63.37,32.96 | 63.37,32.96 63.1,33.45 U7.5 63.2,33.4 63.5,32.8 63.5,28.3 63,27.8 59.9,27.9 v59.1,26.9 | U6.11 57.9,33.9 U6.7 59.6,34.4 59.8,34 59.8,32 59.5,31.7 59.5,30.9 60.1,30.3 60.9,30.3 61.4,30.8 61.4,32.4 61.7,32.7 63.11,32.7 63.37,32.96
  Top 0.305: 22.1,39.8 21.7,40.2 21.7,42.1 21.9,42.3 23.11,42.3 U2.8 v23.1,43.6 | 22.1,39.8 U2.6 | U2.4 23.09,37.2 21.9,37.2 | 21.9,37.2 21.6,37.5 21.6,39.4 22.01,39.8 22.1,39.8 | U2.2 23.13,34.7 | 21.9,34.7 21.6,35 21.6,36.7 21.9,37 21.9,37.2 | U$2.6 7.25,55.15 7.9,54.5 7.9,54.3 8.1,54.1 8.1,53.41 U$2.2 | U$2.6 7.25,55.05 7.8,54.5 9.4,54.5 9.8,54.9 12.3,54.9 12.5,54.7 12.5,53.75 C5.2 | U1.7 24.02,57.9 22.1,57.9 20.87,56.67 U1.3 16.64,56.67 16,57.3 11.2,57.3 10.8,57.7 8.1,57.7 7.4,57 7.4,56.05 U$2.6 | U1.7 U1.8 | U1.7 25.17,57.94 25.6,57.5 26.95,57.5 C2.2 C1.2 | IC1.10 34.52,36.98 35.8,35.7 39.1,35.7 IC1.17 IC1.16 IC1.15 39.1,34.4 38.2,34.4 37.6,34 v37.6,28.7 35.8,28.7 U$3.7 | U$5.2 U$5.1 31.1,24.24 31.1,26.1 31.04,26.16 U$3.4 31.1,26.26 31.1,27.5 31.07,27.47 U$3.3 U$3.2 29.34,28.73 v29.3,28.7 | U$5.2 U$5.3 U$5.4 | U$5.2 31.27,22.94 31.4,22.8 35.73,22.8 U$5.7 | C15.2 73.15,24.4 C9.2 73.05,24.3 C14.2 74.62,23.48 U5.15 74.62,19.83 74.5,19.7 72.8,19.7 72.4,20.1 71.95,20.1 C16.2 | R15E20.2 v21.1,45.1 | U$1.3 24,50.7 24,49.6 23.5,49.1 U$1.7 U$1.6 | IC4.2 8.6,24.1 8.7,24
  Top 0.406: C16.2 70.25,20.55 69.7,20 69.7,17.3 v69.4,17 | C7.2 26.95,49.6 28.7,49.6 31,46.9 35.5,46.9 36.15,46.05 C6.2 36.2,44.6 v36.2,43.6 | 2.8,17.6 2.84,17.58 | 2.84,17.58 3.7,16.7 12.5,16.7 | LED-WIFI.1 12.7,16.9 12.5,16.7 | 12.5,16.7 18.1,16.7 18.4,16.8 18.8,17.5 LED-ERROR.1 | SS49EHALL-ANA.3 8.7,24 8.7,25.8 7.9,26.8 3.4,26.8 1.9,25.7 A3212HALL.3 2.2,23.1 2.2,18.64 SWITCH.1 2.16,18.26 2.84,17.58 | C8.2 18.6,28.2 18.9,28.5 18.9,29.8 20.3,31 21.2,31 22.9,31 22.78,31.1 | 22.78,31.1 22.2,31 C11.2 | 21.9,34.7 21.2,33.6 21.2,31.1 22.78,31.1 | R15E20.2 R15E21.2 | C1.2 v29.1,56.2
  Top 0.61: v24.1,20.3 25.85,20.3 C3.2 C4.2 28.25,20.15 28.2,20.1 30.84,20.1 U$5.4 | 70.54,8.26 v69.4,8.3 | C11.2 23.1,29.7 v25.6,27.3 | 23.13,34.7 21.9,34.7 | SJ5.1 74.5,8.26 H5.2
  Bottom 0.254: v62.6,37.1 63.4,36.4 63.9,35.7 63.9,33.2 v63.6,32.5 | C21.2 36.05,46.45 36.7,45.6 39.1,45.6 39.1,45.63 39.01,45.52
  Bottom 0.305: v29.3,28.7 v37.6,28.7 | 69.4,11.3 69.4,11.4 | v21.1,45.1 v23.1,43.6 | 40.98,53.12 41.2,52.9 | C20.2 42.05,45.89 41.2,46.84 | U8.8 49.91,47.39 50.1,47.2 50.1,43.1 49.8,42.8 48.74,42.8 U8.1 48.73,42.13 46.6,40 | 46.6,40 44.9,40 44.6,39.7 42.66,39.7 41.93,40.43 | U8.14 56.3,44.1 56.7,43.7 56.7,42.5 56.3,42 52.9,42 50.8,40 46.6,40 | v39.6,17.3 39.6,17.76 39.79,17.95
  Bottom 0.406: v69.4,17 68.6,17 68.4,16.8 | LED-ERROR.1 23,18.7 23.1,18.6 24.1,18.6 | v29.1,56.2 31,56.2 31.5,55.7 31.5,54.1 28,53.1 28,46.5 29.5,43.6 v36.2,43.6 38.4,43.6 39,44.2 39.01,45.52 41.2,48 | R15E22.2 40.98,53.12
  Bottom 0.61: 69.4,11.4 69.2,11.4 68.4,12.2 68.4,16.8 68.4,23.3 64.7,26.9 v59.1,26.9 40.4,26.9 | 40.4,26.9 40.2,26.9 40.2,29.7 38.7,31.2 37.2,31.2 36.1,32.5 35.9,32.8 35.9,34.5 37.2,35.8 39.8,38.3 41.93,40.43 43.5,41.8 43.5,44.1 41.2,46.84 41.2,48 41.2,52.9 41.2,54.7 SV1.1 | 40.4,26.9 40.2,26.7 40.2,18.3 39.79,17.95 39.5,17.7 24.1,17.8 24.1,18.6 v24.1,20.3 | v69.4,8.3 69.4,11.3 | v25.6,27.3 27.4,28.7 v29.3,28.7
  other vias: 22.7,17.1 69.4,2.8 56.9,46.2 63,14.4 67.5,9.7 49.7,22.7 83.2,2 83.6,17.3 65.5,14.6 54.1,33.1 57.9,56 58.9,59.1 54.8,51 39.7,58.7 52,50.1 6.2,59.8 12.1,59.9 15,53.9 38.7,56.7 28,23.6 9.1,27.2 1.3,26.9 20.7,20 23.8,24.1 20.7,17.4 33.5,19.6 59,26.9
  pour Bottom (isolate 0.61): 0.2,60.9 60.7,60.9 60.9,60.7 60.9,45.1 60.8,45 85.1,20.7 84.9,0.6 84.6,0.2 71.9,0.1 70.8,0.1 55.2,16 0,16 0,61.1
  pour Top (isolate 0.61): 0,60.9 60.7,60.9 60.9,60.7 60.9,44.8 84.9,20.8 84.9,0.6 84,0.2 70.6,0 55.3,15.9 0.3,15.9 0.2,16 0.2,60.7 0.3,60.8
B-485-1-RX-TIME
  Top 0.305: JP3.1 56.4,19.2 70.8,4.8 71.4,4.3 71.4,2.3 71.8,2 75.66,2 JP1.6 77.6,4.7 77.6,7.1 78.3,7.8 78.9,7.8 80,8.9 80,10.9 81.77,11.98 81.8,13.9 81,14.7 U5.7
DAC1
  Top 0.305: U$2.1 5.85,53.25 4.9,53.1 3.41,53.1 JP4.10
GND-485-1  (via drill 0.6)
  Top 0.254: SJ5.2 71.2,5.6 72.5,4.3 72.92,4.3 JP1.8
  Top 0.305: JP5.1 45.5,19.2 47.9,16.8
  Top 0.406: 47.9,16.8 56.8,16.8 68.7,4.8 68.7,4.5 v69,4.2
  Bottom 0.406: v69,4.2 69.6,4.2 70.6,3.2 73.56,3.2 JP1.8
GND-IN  (via drill 0.6)  (1 unrouted)
  Top 0.813: IC2.1 68.76,43.8 | 68.76,43.8 68.76,40.9 JP6.3 | C17.2 68.41,44.15 68.76,43.8 | C18.2 76.9,46.2 v79.2,48.5
  Bottom 0.813: v79.2,48.5 79.1,48.5 75.9,45.3 75.9,40 75.1,39.2 70.26,39.2 JP6.3
  other vias: 63,58.1 64.1,52.7 66.4,42.5 62.8,51 62.7,55.1 78.4,54.8 80.5,56.6 78,59.9 78.5,50.9 80.4,53.3 64.5,59.6 80,45
  pour Top (isolate 0.61): 61,61 81.3,61 81.4,60.9 81.4,44.3 81.4,44.2 75.6,38.4 67.9,38.4 67.7,38.2 67.7,38.3 61.1,44.9 61.1,60.9
  pour Bottom (isolate 0.61): 61.1,60.8 81.4,60.8 81.6,61 81.6,44.5 81.5,44.4 75.5,38.4 67.8,38.4 67.7,38.3 67.6,38.3 60.9,45 60.9,60.7
GND-IN12
  Top 0.305: U4.2 10.58,50 11.9,50 12.2,49.7 12.2,46.7 11.6,46.1 11.4,46.1 11.37,46.06 U3.2 10.48,46 6,46 5.27,45.27 JP4.7
GND-IO1/4  (via drill 0.6)
  Top 0.305: 18.1,39.9 18.4,40.2 18.4,41.8 17.9,42.3 16.89,42.3 U2.9 17.65,42.45 C10.2 | 17.6,39.9 18.1,39.9 | 18.1,39.9 18.4,39.6 18.4,39.5 | 18.3,37.3 18.27,37.27 | 18.27,37.27 U2.13 | U2.15 16.92,34.8 18.1,34.8 18.6,35.3 | 18.3,37.2 18.27,37.23 18.27,37.27 | Q5.2 8.73,43.8 v10,43.6 | Q4.2 v10,39.6 | Q3.2 v10,35.8 | Q2.2 8.63,31.9 v9.8,31.9 | 18.1,39.9 18.01,39.8 U2.11 18.1,39.8 18.4,39.5 | 18.4,39.5 18.4,37.4 18.3,37.3 | 18.3,37.3 18.3,37.2 | 18.3,37.2 18.6,36.9 18.6,35.3 | 18.6,35.3 18.6,32.8 17.1,31.3 15.6,31.3 13,28.6 6.3,28.6 6,28.3 4.93,28.3 JP4.1
  Bottom 0.305: 10.1,43.5 v10,43.6 9.7,43.9 1.7,43.9 0.9,43.1 0.9,38.9 | v10,39.6 10.1,39.5 5.7,39.5 5,38.9 0.9,38.9 | 10,35.7 v10,35.8 6.4,35.8 4.5,33.9 1,33.9 0.9,33.8 | 9.9,31.9 v9.8,31.9 5.5,31.9 4.9,31.3 0.9,31.3 | JP4.1 1.37,30.03 0.9,30.5 0.9,31.3 | 0.9,31.3 0.9,33.8 | 0.9,33.8 0.9,38.9
GPA6
  Top 0.305: SJ4.2 29.76,50.84 29.8,50.8 29.8,49.7 31.5,47.6 36.6,47.6 37.2,47 37.2,42.6 37.8,42.2 39.1,42.2 IC1.27
GPA7  (via drill 0.6)
  Top 0.254: IC1.28 39.23,42.83 v39.8,43.7 | v40.6,45.8 40.7,45.8 40.6,45.9 38.8,45.9 38.3,46.4 38.3,48.6 40.2,50.5 42.55,50.5 U$4.S 43.25,50.45 43.7,50 46.4,50 46.6,50.2 47.12,50.7 R15E28.1
  Bottom 0.254: v39.8,43.7 39.8,45.4 40.3,45.8 v40.6,45.8
GPB0
  Top 0.305: IC1.1 28.44,42.83 R15E6.1
GPB1
  Top 0.305: R15E3.1 28.3,40.3 28.5,40.7 28.5,41.6 28.8,42.2 31.5,42.2 31.5,42.1 IC1.2
GPB2
  Top 0.254: 29,38.2 29,41.3 29.2,41.5 31.55,41.5 IC1.3
  Top 0.305: R15E2.2 28.22,37.52 29,38.2
GPB3
  Top 0.254: R15E1.2 29.2,35.5 29.5,35.9 29.5,40.5 29.8,40.9 31.55,40.9 IC1.4
GPB6  (via drill 0.6)
  Top 0.254: IC1.7 30.98,38.92 30.8,39.1 30.7,39.8 v30.4,40.1
  Top 0.305: R15E20.1 19.08,46.78 18.4,46.1 16.89,46.1 U3.3 16.82,46.1 v14.8,46.1
  Bottom 0.305: v30.4,40.1 28.1,40.1 22.1,46.1 21.9,46.1 v14.8,46.1
GPB7  (via drill 0.6)
  Top 0.305: U4.3 17.02,49.8 R15E21.1 19.1,49.82 19.1,50.7 19.7,51.3 v19.9,51.4 | IC1.8 30.53,38.27 30.5,38.3 30.4,38.3 v30.3,38.4
  Bottom 0.305: v30.3,38.4 30.4,38.4 31.4,39.4 31.4,40.4 30.7,41.1 28.1,41.1 22.1,47.1 v19.9,51.4
IN1
  Top 0.305: JP4.8 3.41,47.6 R15E18.2
IN2
  Top 0.305: JP4.9 3.25,50.3 R15E19.2
INT-DISPLAY  (via drill 0.6)
  Top 0.305: v42.1,33.6 42.1,34.2 41.6,34.7 41.6,39.4 40.8,40.2 39.15,40.2 IC1.24
  Bottom 0.305: 74.8,8.9 74.8,10.8
  Bottom 0.406: JP1.5 76.33,7.47 74.8,8.9 | 74.8,10.8 74.6,11.4 74.6,14.6 73.7,15.6 70.2,19.1 70.2,23.8 65.2,28.8 46,28.8 42.4,32.4 v42.1,33.6
INT-MCP23017  (via drill 0.6)
  Top 0.305: v41,32.8 40.9,32.9 40.9,37.2 40.6,37.6 39.15,37.6 IC1.20
  Bottom 0.305: 42.2,31.4 41,32.7 v41,32.8
  Bottom 0.406: JP1.7 73.79,7.31 72,9.1 72,10.9 72.4,11.3 73.1,11.3 73.6,11.9 73.6,14.1 69.3,18.7 69.3,23.6 65,27.9 45.7,27.9 42.2,31.4
INT-RTC  (via drill 0.6)
  Top 0.305: v43.3,33 43.3,34 42.3,35 42.3,39.5 41.1,40.9 39.15,40.9 IC1.25
  Bottom 0.305: 77.5,8.9 77.5,11.1
  Bottom 0.406: JP1.2 81.41,3.11 80.2,1.9 77.8,1.9 77.6,2.1 77.6,8.6 77.5,8.9 | 77.5,11.1 77.5,11.2 77.7,11.4 77.7,13.1 74.3,16.3 71.2,19.4 71.2,23.9 65.4,29.7 46.4,29.7 43.6,32.5 v43.3,33
LED  (via drill 0.6)
  Top 0.254: v45,52.7 44.9,52.6 U$4.D 45,51.4 | v50.3,52.8 49.22,52.8 R15E29.1
  Bottom 0.254: v45,52.7 50.2,52.7 v50.3,52.8 50,52.5 50,49.9 51.3,48.2 55.3,48.2 55.8,47.7 55.8,45.1 57.3,44.4 57.3,42.1 56.5,41.3 53.2,41.3 51.3,39.4 49.9,39.4 49.3,38.8 SV2.3
N$1
  Top 0.305: Q1.2 36.6,56.25 R2.1 37.1,56.75 PTC1.2
N$2
  Top 0.305: U5.1 73.2,16.1 71.4,14.3 71.4,13.45 C13.1
N$3
  Top 0.406: SJ1.2 72.86,31.44 59.4,44.9 59.4,56.5 57.4,58.5 52.81,58.5 SV1.4
N$4
  Top 0.305: R2.2 36.6,54.35 Q1.1 34.25,54.1 29.6,54.1 28,55.7 25.9,55.7 25,56.6 23.9,56.6 23.96,56.67 U1.6
N$5  (via drill 0.6)
  Top 0.305: R15E8.2 Q2.1 7.7,29.2 v5.4,29.2 | v15.2,40.8 15.8,40.9 16.77,41 U2.10
  Bottom 0.305: v5.4,29.2 12.6,29.2 17.8,35.3 17.8,39 16.7,40.8 v15.2,40.8
N$6
  Top 0.305: R15E2.1 25.1,37.2 23.7,36 U2.3
N$7
  Top 0.305: R15E1.1 25.28,34.48 24,33.4 23.21,33.4 U2.1
N$8  (via drill 0.6)
  Top 0.305: IC1.21 38.1,38.3 37.5,37.7 36.3,37.7 v35.9,38.5 | v12.9,21.7 R15E4.2 | v23.2,27.1 v21.9,28.7
  Bottom 0.305: v35.9,38.5 35.7,38.3 35.7,36.7 31.5,32.6 28.4,32.6 23.3,27.5 v23.2,27.1 | v21.9,28.7 16.2,23.1 15.7,22.7 13.8,22.7 v12.9,21.7 11,21.7 10.1,20.8 4.9,20.8 4.6,20.5 4.6,18.7 SWITCH.2
N$9  (via drill 0.6)
  Top 0.254: LED-ERROR.2 16.2,19.2 16.9,20.5 17.9,20.5 18.5,20.8 R15E5.1
  Top 0.305: IC1.22 37.6,38.9 v37.2,38.6 | v22.2,26 22.2,23.6 20.9,22.5 20.8,22.4 19.7,22.4 18.98,21.68 R15E5.1
  Bottom 0.305: v37.2,38.6 37.6,38.2 37.6,37.4 37.4,37.2 36.5,37.2 36.4,37 36.4,36.5 31.8,32 28.9,32 24.3,27.4 24.3,26.7 23.7,26.1 22.5,26.1 v22.2,26
N$10  (via drill 0.6)
  Top 0.254: LED-WIFI.2 10.1,19.9 10.8,20.6 12.9,20.6 | 13.1,20.6 15.6,20.6 16.3,21.1 R15E9.1
  Top 0.305: IC1.23 37.6,39.6 v36.9,39.9 | v11.3,20.6 12.9,20.6 13.1,20.6
  Bottom 0.305: v36.9,39.9 35.6,39.9 34.9,39.3 34.9,36.9 31.1,33.2 28,33.2 16.6,21.8 15,21.8 13.8,20.6 v11.3,20.6
N$11
  Top 0.305: U2.5 24.32,38.94 R15E3.2
N$12
  Top 0.305: R15E6.2 25.6,42.3 23.9,41.1 23.18,41.1 U2.7
N$13  (via drill 0.6)
  Top 0.305: R15E10.2 Q3.1 8.41,34.01 8,33.6 6.9,33.6 6.6,33.3 5.5,33.3 v5.4,33.4 | v15.3,38.9 16.78,38.6 U2.12
  Bottom 0.305: v5.4,33.4 15.3,33.4 16.9,35.4 16.9,37.6 16.4,38.1 15.8,38.1 v15.3,38.9
N$14  (via drill 0.6)
  Top 0.305: R15E13.2 8.71,37.9 Q4.1 8.41,37.81 8,37.4 7.3,37.4 6.8,36.9 5.7,36.9 v5.5,36.7 | v15.4,36 U2.14
  Bottom 0.305: v5.5,36.7 15,36.7 v15.4,36
N$15  (via drill 0.6)
  Top 0.305: Q5.1 10.17,41.81 R15E16.2 10.08,41.9 8.7,41.9 8.2,41.4 7.2,41.4 7.1,41.3 v5.3,41.3 | v16.6,32.3 16.6,33.21 U2.16 | C10.1 16.65,44.25 v15,43.1
  Bottom 0.305: v5.3,41.3 6.4,41.8 15,41.8 | 15,41.8 17.9,41.8 18.6,41.3 18.6,34.3 18,33.5 17.8,33.5 v16.6,32.3 | v15,43.1 15,41.8
N$16
  Top 0.305: U5.3 75.89,15.09 74.9,14.1 73.95,14.1 C13.2
N$17
  Top 0.305: U4.1 10.38,51.4 8.6,51.4 7.82,50.62 R15E19.1
N$18
  Top 0.305: R15E18.1 8.18,47.33 U3.1
N$19
  Top 0.305: SJ4.1 26.5,52.8 24.8,52.8 24.5,52.5 U$1.2
N$20
  Top 0.305: U5.4 77.16,15.53 77.3,15.4 77.6,13.85 C12.1
N$21
  Top 0.305: U5.5 78.43,14.87 80,14.2 80,13.15 C12.2
N$25  (via drill 0.6)
  Top 0.254: v79.8,19.3 75.5,19.3 74.6,18.1 74.6,16.12 U5.2
  Top 0.406: C14.1 77.6,24.3 v78.8,23.1
  Bottom 0.254: v78.8,23.1 78.8,21.6 v79.8,19.3
N$26  (via drill 0.6)
  Top 0.305: C15.1 75.2,26.9 75.3,26.8 76.4,26.8 v76.9,26.3 | v82.4,19.1 81.8,18.3 80.6,18.3 79.7,17.49 U5.6
  Bottom 0.305: v76.9,26.3 80.2,23 82.4,20.9 v82.4,19.1
N$27
  Top 0.61: 69.6,8.4 71.2,8.3
N$28  (via drill 0.6)
  Top 0.406: 69.5,8.3 69.4,8.3 v69.4,9.2
N$29  (via drill 0.6)
  other vias: 67.7,59
N$30  (via drill 0.6)
  other vias: 67.9,55.1
N$31  (via drill 0.6)
  other vias: 74,55
N$32  (via drill 0.6)
  other vias: 73.7,58.9
N$33  (via drill 0.6)
  other vias: 71,58.9
N$34  (via drill 0.6)
  other vias: 71.1,55.1
N$35
  Top 0.254: R15E24.2 55.7,38 55.2,37.5 55.2,35.9 55.5,35.6 U6.2
N$38
  Bottom 0.305: IF-D92.1 36.85,49.53 R15E14.1
N$39  (via drill 0.6)
  Top 0.305: v39.5,47.6 39.5,48.1 40.4,49.2 47.3,49.2 47.9,48.6 47.9,43.9 v47,43
  Bottom 0.254: C21.1 38.9,47 v39.5,47.6
  Bottom 0.305: R15E22.1 39.32,50.97 R15E14.2 39.32,47.78 v39.5,47.6 | v47,43 47.5,43.5 48.7,43.5 U8.2
N$40
  Top 0.254: U6.4 U6.5
N$41
  Bottom 0.254: 44.95,43.77 44.95,44.05 44.3,44.7 44.3,47.75 D1.1 | D1.1 42.85,48.1 C20.1 | D1.1 44.65,48.45 44.3,48.8 44.3,49.15 44.65,49.5
  Bottom 0.305: 44.95,43.77 R15E23.2 | U8.15 52.23,43.47 50.9,44.8 50.9,47.3 49.4,49.5 44.65,49.5
OPT1-IN  (via drill 0.6)
  Top 0.305: IC1.6 33.48,39.58 34.2,40.2 34.2,41.3 v34.3,41.3 | v42.3,42.2 42.8,42 50.9,42 52.5,43.6 v52.5,44.7
  Bottom 0.305: v34.3,41.3 34.7,41.8 35.5,41.9 35.7,42.1 42.2,42.1 v42.3,42.2 | v52.5,44.7 54.4,44.7 U8.13
OPT1-RST  (via drill 0.6)
  Top 0.305: IC1.5 32.93,40.22 33.4,40.6 33.4,42.4 v33.9,42.7 | v42,43.5 42.2,43.4 42.4,43.4 43.2,44.3 v47,44.4
  Bottom 0.305: v33.9,42.7 40.7,42.7 41.4,43.4 v42,43.5 | v47,44.4 47.66,44.1 U8.3
OUT1
  Top 0.305: R15E7.2 10.78,32.9 7.4,32.9 6.48,31.98 Q2.3 6.5,30.92 6.5,31.9 5.7,32.5 3.3,32.5 3.07,32.27 JP4.2
OUT2
  Top 0.305: R15E11.2 10.88,36.8 7.6,36.8 6.58,35.78 Q3.3 6.37,35.11 JP4.3
OUT3
  Top 0.305: R15E12.2 10.68,40.7 8,40.7 6.6,39.5 | 6.6,39.5 6.58,39.48 Q4.3 6.6,38.72 6.6,39.5 | 6.6,39.5 6,40.1 6,40.2 5.99,40.19 JP4.5
OUT4
  Top 0.305: R15E15.2 10.7,44.6 6.9,44.6 6.4,44.1 6.4,42.72 Q5.3 3.43,42.8 JP4.6
RX-EXP  (via drill 0.6)
  Top 0.406: SJ2.2 69.2,31.4 v70.1,32.3 | v83.9,19.9 83.9,20.5 83,21.4 82.34,21.4 U5.9
  Bottom 0.305: 80.2,24.2 80.1,24.3
  Bottom 0.406: 80.2,24.2 74,30.5 72.5,30.5 70.7,32.3 v70.1,32.3 69.3,33.1 69.4,34 58.7,44.7 58.7,54.3 58.4,54.9 56.8,54.9 55.5,56.2 51.1,56.2 50.27,56.83 SV1.3 | 80.1,24.3 83.8,20.6 83.8,20 v83.9,19.9
S-GND  (via drill 0.6)
  Top 0.305: R15E27.2 43.9,24.5 44.7,25.3 46,25.3 46.1,25.2 46.7,25.2 C22.-
  Top 0.406: SV2.2 SV2.4 | C22.- 46.5,25.1 45.4,26.2 45.4,26.5 v43.7,28.2
  Bottom 0.406: v43.7,28.2 43.7,28.6 39.3,33 38.5,33 38.3,33.2 38.3,34 41.5,37.1 47.93,37.1 SV2.4
SCL  (via drill 0.6)
  Top 0.254: IC3.4 58.12,39.67 58.1,39.6 58.4,39.3 60.2,39.3 61.6,37.9 61.6,37.2 v61.3,36.6 | v61.3,36.6 61.4,36.5 61.4,36.35 U7.2 62,35.3 v61.3,36.6 | U6.10 58.9,36.7 v59.6,37.7
  Top 0.305: U$2.5 8.2,56.4 8.9,57.2 9.8,57.2 11.1,56.2 16.1,56.2 17.2,55.3 19.05,55.3 U1.4 19.25,55.5 v21,55.5 | v30.3,35.9 30.5,35.7 30.6,35.7 30.62,35.67 IC1.12 33.52,35.67 33.8,35.4 33.8,28.2 34.6,27.4 35.7,27.4 U$3.6 35.83,27.4 37.4,27.4 38.51,26.66 38.6,26.6 38.6,22.6 37.47,21.66 U$5.6 | U$1.10 25.1,47 25.5,46.6 26.3,46.6 v26.8,46
  Top 0.406: v47.7,32 47.7,31.5 47,30.8 40.9,30.8 39.1,29 39.1,27.25 38.51,26.66
  Bottom 0.254: v61.3,36.6 61,36.5 | 61,36.5 61,36 61,32.4 | 61,36.5 61,36.6 v59.6,37.7
  Bottom 0.305: v30.3,35.9 31.4,35.9 31.7,36.2 31.7,37.8 32.7,38.6 32.7,40.9 31.4,42.7 28.9,42.7 v26.8,46 26.8,54.2 26.5,54.5 22,54.5 v21,55.5
  Bottom 0.406: H5.4 81.22,12.08 73.2,20.1 73.2,24.4 66,31.6 61.8,31.6 61,32.4 59.8,32.4 59.4,31.6 47.7,31.6 47.5,31.8 v47.7,32
SDA  (via drill 0.6)  (1 unrouted)
  Top 0.254: U$1.9 24.6,46.1 25.1,45.6 v25.1,45.5 | IC3.3 58.77,40.62 58.3,41 57.8,41 57.5,40.6 57.5,39.5 58.3,38.7 60.1,38.7 60.5,38.3 60.5,35.6 | v60.5,31.3 60.5,33.6 60.83,33.78 | U7.4 60.95,33.85 60.83,33.78 | 60.5,35.6 60.5,34.12 60.83,33.78 | U6.9 60.5,35.6
  Top 0.305: U$2.4 9.15,55.95 9.4,56.2 9.8,56.2 10.9,55.5 15.5,55.5 17.3,54.3 21.3,54.3 22.4,55.4 23.3,55.4 23.4,55.3 | v29.6,34.8 30,35 30.9,35 30.93,35.02 IC1.13 33.08,35.02 33.2,34.9 33.2,27.6 34.6,26.2 U$3.5 36.4,26.2 37.3,26.2 37.6,25.9 v37.6,25.2 | v24.3,53.5 24.2,53.5 24,53.7 24,55.34 U1.5 | 35.8,20.3 35.86,20.36 U$5.5 35.96,20.3 37,20.3 37.5,20.8 v37.6,20.8
  Top 0.406: v46.1,31.8 40.5,31.8 v38.5,29.8
  Bottom 0.254: v60.5,31.3 60.4,30.7
  Bottom 0.305: v29.6,34.8 29.8,35 29.3,35.5 29.3,36.3 29.9,36.9 30.2,36.9 31,37.7 31.1,38.1 32,39.1 32,40.6 31,41.9 28.6,41.9 27.3,43.2 v25.1,45.5 25.1,52.6 24.5,53.5 v24.3,53.5 | v37.6,25.2 v37.6,20.8
  Bottom 0.406: H5.3 78.68,13.42 72.3,19.8 72.3,24.1 65.7,30.7 60.4,30.7 46.8,30.7 46.2,31.3 46.2,31.7 v46.1,31.8 | v38.5,29.8 38.5,27.8 37.7,27 37.7,25.3 v37.6,25.2
SIGNALHALL  (via drill 0.6)
  Top 0.305: IC1.26 36.43,41.53 v36.2,41.3 | R15E17.2 16.6,27.5 15.1,27.5 15.1,27.2 v14.9,27.2 | IC4.3 5.27,25.37 A3212HALL.2
  Bottom 0.305: v36.2,41.3 35.3,40.7 34.3,39.9 34.3,37.3 30.8,33.8 27.7,33.8 23.5,29.6 21.4,29.6 19.3,27.5 R15E17.2 | R15E17.2 14.88,25.9 7.23,25.9 IC4.3 | R15E17.2 16.6,27.5 15.5,26.4 15.5,26.6 v14.9,27.2
TX-EXP  (via drill 0.6)
  Top 0.305: U5.10 80.97,19.12 v81.1,19.1 | v67.5,33.8 67.66,34.6 SJ3.2
  Bottom 0.305: v81.1,19.1 80.9,19.1 80.2,18.4 79.4,18.4 78.8,19 78.8,20.2 77.9,21.1 77.9,23.4 v67.5,33.8
  Bottom 0.406: SV1.2 47.73,56.47 48.3,55.4 55,55.4 56.8,53.8 57.6,53.8 58,52.9 58,44.2 67.6,34.8 v67.5,33.8
V0  (via drill 0.6)
  Top 0.305: v42.2,28.6 41.7,28.6 41.4,28.3 41.4,25.3 41.5,25.2 41.5,24.82 R15E26.2
  Bottom 0.305: SV2.5 41.27,38.37 37.1,34.2 37.1,33 37.7,32.2 39.1,32.2 41.7,29.5 42,28.8 v42.2,28.6
V-LED  (via drill 0.6)
  Top 0.305: C22.+ 53.7,25.1 54.7,24.1 56.9,24.1 v57.4,23.8 | v57.9,25.9 58,26 54.9,29.1 52.2,29.1 51.7,29.6 51.7,32.7 53.3,34.3 53.3,36.8 52.9,37.3 52.71,37.5 SV2.1
  Top 0.406: C22.+ 52.2,23.98 R15E25.2
  Bottom 0.305: v57.4,23.8 57.4,25.2 v57.9,25.9
VCC-OUT1/4  (via drill 0.6)
  Top 0.305: R15E15.1 13.42,43 R15E16.1 13.72,40.3 R15E12.1 13.7,39.78 13.7,38.6 13,37.9 R15E13.1 13.72,36.3 R15E11.1 13.72,35.4 R15E10.1 12.9,34 13.5,33.4 13.5,32.22 R15E7.1 13.72,30.42 13.5,30.2 12.42,30.2 R15E8.1 12.52,30.3
  Top 0.406: v14.4,38 14.3,38 13.7,38.6
  Bottom 0.406: JP4.4 4.05,37.65 4.1,37.6 4.8,37.6 5.1,37.9 14.3,37.9 v14.4,38
VOUT  (via drill 0.6)  (1 unrouted)
  Top 0.813: IC2.2 71.3,40.9 JP6.2 | C17.1 66.65,47.25 66.8,46.9 66.2,46.9 v66.2,49 | 71.3,45.7 71.3,54.3 71.6,54.6
  Bottom 0.813: v66.2,49 68.4,44.2 71,44.2 71.3,43.9 71.3,40.9 JP6.2
(copper drawn outside any net)
  shapes: Bottom area x1